# EAGLE design led (EAGLE 7.2.0)
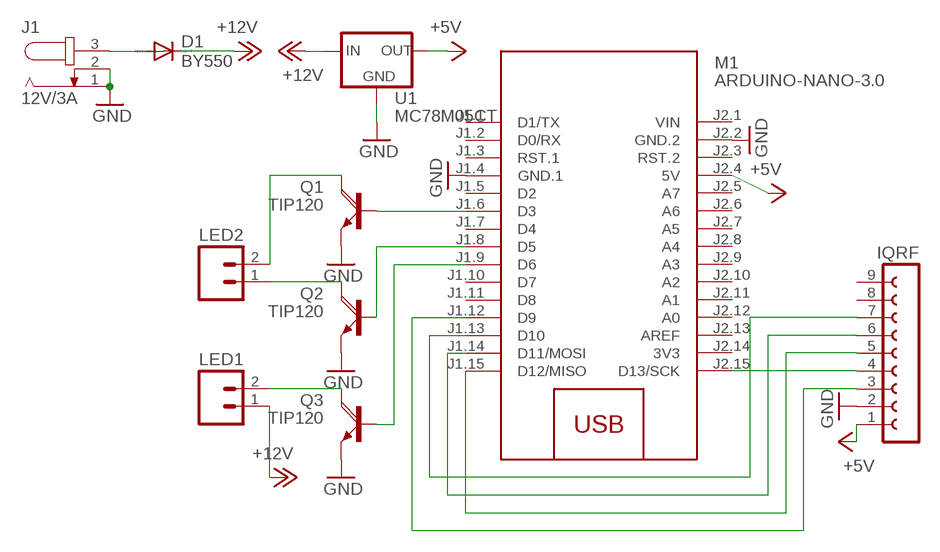
[diagram p0: schematic, sheet 1]

## Parts
D1  BY550  [DO27-15]
IQRF  FE09-1  [FE09]
J1  12V/3A  JACK-PLUG0  [SPC4077]
LED1  M025MM  [SCREWTERMINAL-5MM-2]
LED2  M025MM  [SCREWTERMINAL-5MM-2]
M1  ARDUINO-NANO-3.0  [ARDUINO-NANO-3.0]
Q1  TIP120  [TO220AH]
Q2  TIP120  [TO220AH]
Q3  TIP120  [TO220AH]
U1  MC78M05CT  V_REG_78XX-TO-220  [TO-220-ALT]

## Nets
+5V: IQRF.1 M1.J2.4(5V) U1.OUT
+12V [3amp]: D1.C LED1.1 U1.IN
GND: IQRF.2 J1.1 J1.2 M1.J1.4(GND.1) M1.J2.2(GND.2) Q1.E Q2.E Q3.E U1.GND
N$1 [3amp]: D1.A J1.3
N$2: M1.J1.6(D3) Q1.B
N$3: M1.J1.8(D5) Q2.B
N$4: M1.J1.9(D6) Q3.B
N$5 [3amp]: LED1.2 Q3.C
N$6 [3amp]: LED2.1 Q2.C
N$7 [3amp]: LED2.2 Q1.C
N$8: IQRF.4 M1.J2.15(D13/SCK)
N$9: IQRF.3 M1.J1.12(D9)
N$10: IQRF.5 M1.J1.15(D12/MISO)
N$11: IQRF.6 M1.J1.14(D11/MOSI)
N$12: IQRF.7 M1.J1.13(D10)
Unconnected: IQRF.8 IQRF.9 M1.J1.1(D1/TX) M1.J1.2(D0/RX) M1.J1.3(RST.1) M1.J1.5(D2) M1.J1.7(D4) M1.J1.10(D7) M1.J1.11(D8) M1.J2.3(RST.2) M1.J2.5(A7) M1.J2.6(A6) M1.J2.7(A5) M1.J2.8(A4) M1.J2.9(A3) M1.J2.10(A2) M1.J2.11(A1) M1.J2.12(A0) M1.J2.13(AREF)

## Power pins joined to a net without a drawn wire
3V3: M1.J2.14(3V3)
VIN: M1.J2.1(VIN)

## Library data of the parts
D1 = diode:BY550: DIODE Si200 V, 5 A
IQRF = con-lsta:FE09-1: FEMALE HEADER; OC_FARNELL: unknown; OC_NEWARK: unknown
J1 = con-jack:JACK-PLUG: DC POWER JACK Power Jack, DC, Right Angle, Through Hole, Rated 5A at 16VDC, PC Terminals Distributor: Farnell (www.Farnell.de) Drawing: 84N1161.pdf / 84N1162.pdf Manufacturer: SPC Technology (www.spctechnology.com) Type: SPC4077 / SPC 4078; OC_FARNELL: unknown; OC_NEWARK: unknown
LED1 LED2 = SparkFun-Connectors:M02: Standard 2-pin 0.1" header. Use with - straight break away headers ( PRT-00116) - right angle break away headers (PRT-00553) - swiss pins (PRT-00743) - machine pins (PRT-00117) - female headers (PRT-00115) Molex polarized connector foot print use with: PRT-08233 with associated crimp pins and housings. 2.54_SCREWTERM for use with PRT-10571. 3.5mm Screw Terminal footprints for PRT-08084 5mm Screw Terminal footprints for use with PRT-08432; STOREFRONT_ID: PRT-08432
M1 = diy-modules:ARDUINO-NANO-3.0: Arduino Nano 3.0
Q1-Q3 = transistor-power:TIP120: NPN DARLINGTON TRANSISTOR
U1 = SparkFun-PowerIC:V_REG_78XX: Voltage Regulator Standard 78xx regulator. IGO (Input Ground Output). Spark Fun Electronics SKU : COM-00107; PROD_ID: VREG-08450; SF_ID: COM-00107

## Net classes
0 default: width 0.102 mm, clearance 0.041 mm
1 3amp: width 1.016 mm, clearance 0.406 mm

## Board
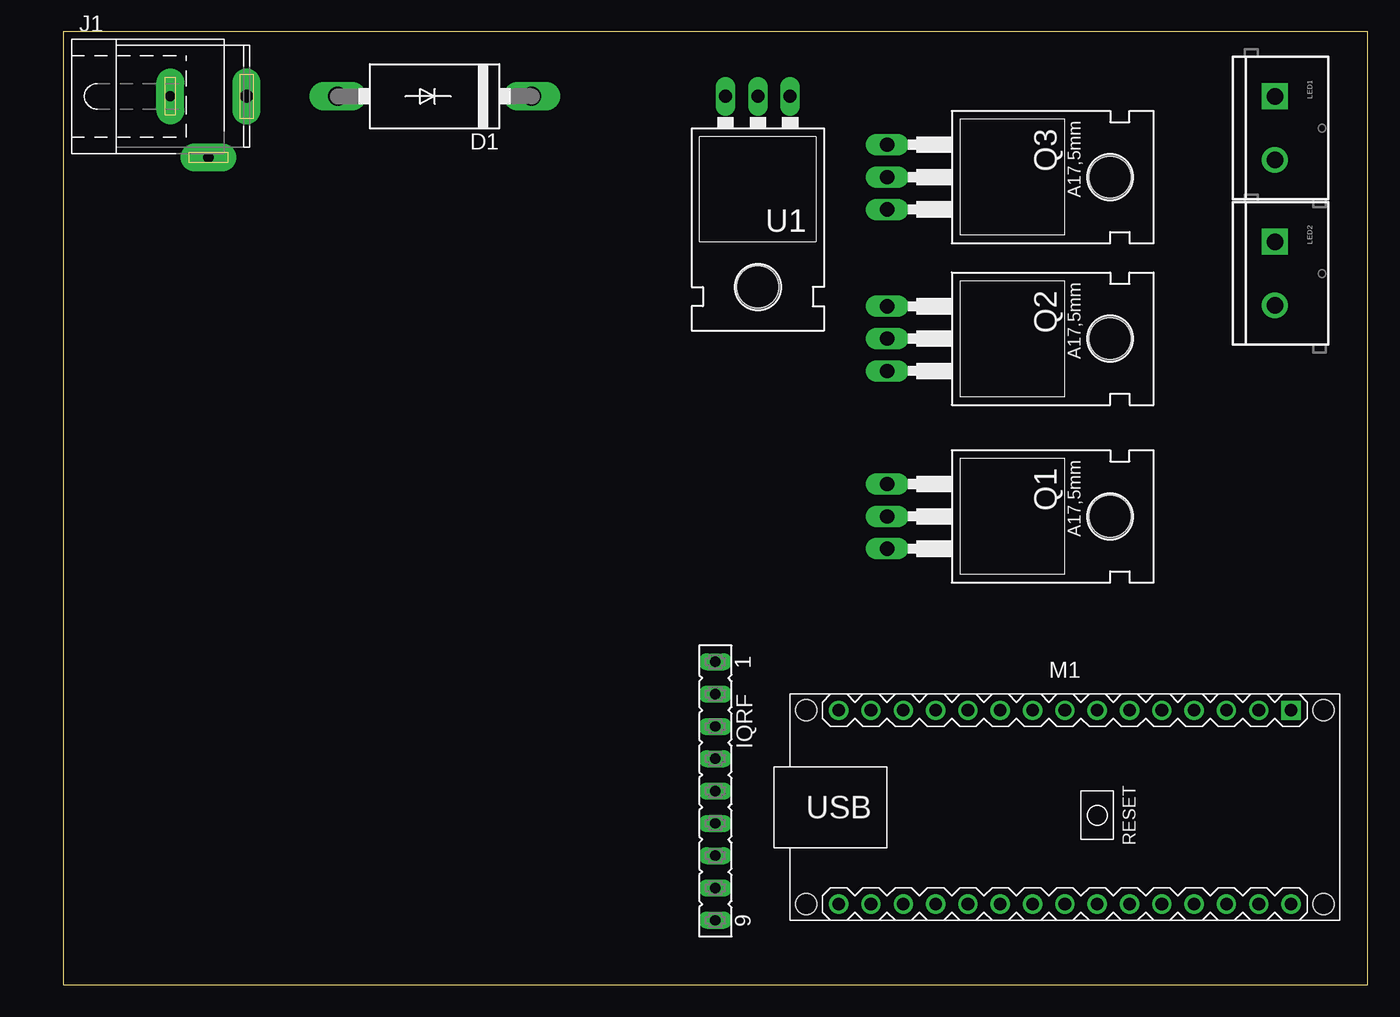
[diagram p1: board, top side]
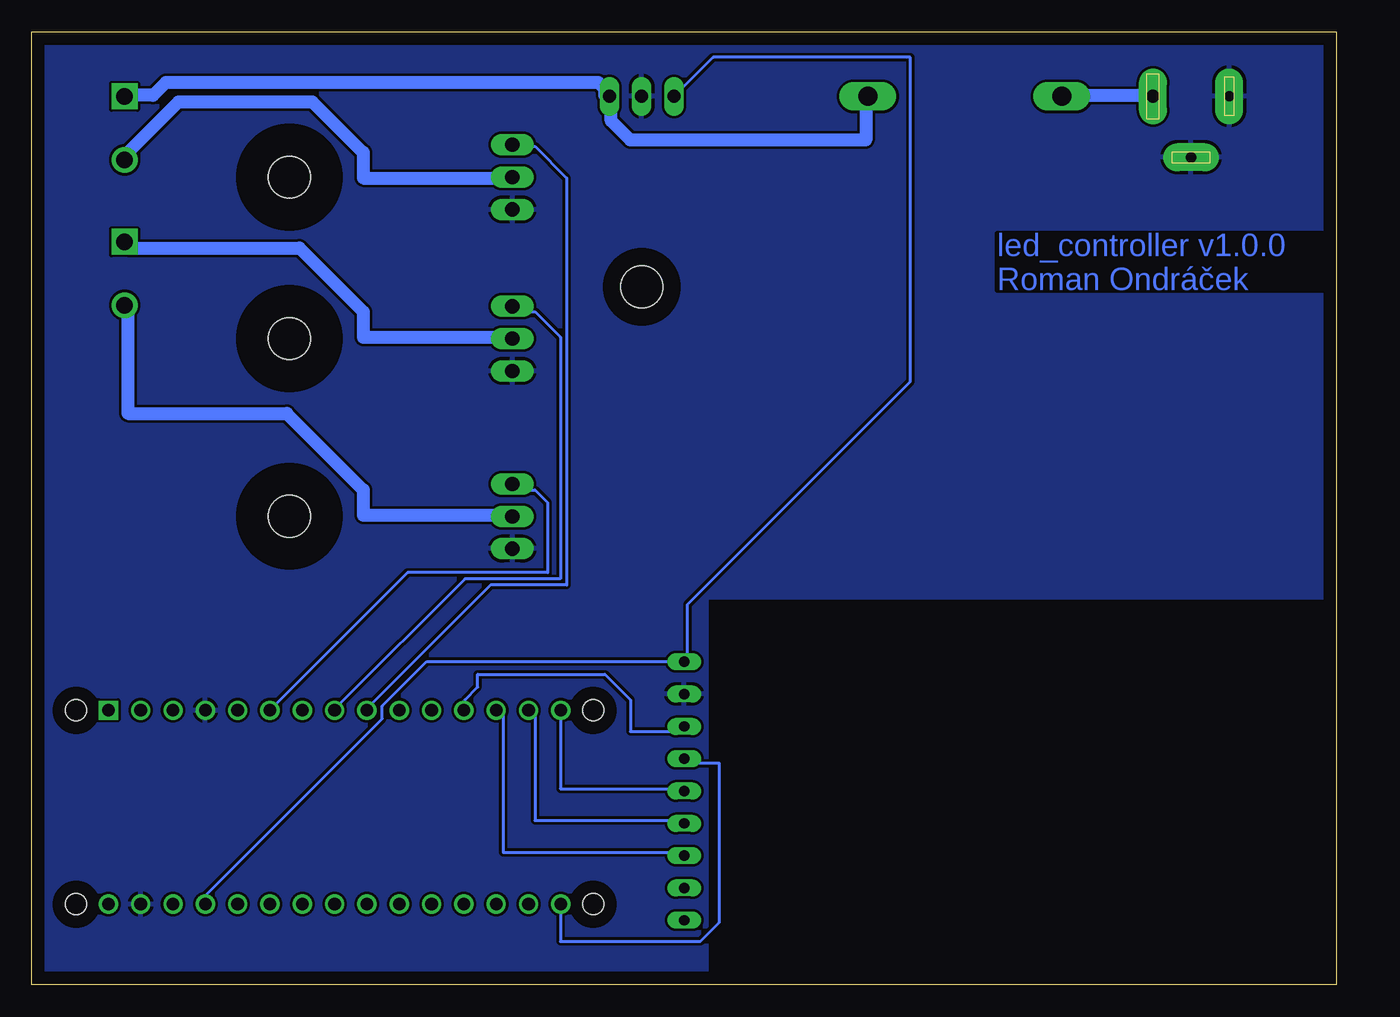
[diagram p2: board, bottom side, seen from below]

Size 102.54 x 74.92 mm. Coordinates in mm from the lower left corner, seen from the top.
Outline: 0,0 102.54,0 102.54,74.92 0,74.92 0,0
Copper layers (1*16): Top 0.035mm / dielectric 1.5mm / Bottom 0.035mm
Design rules "default": minimum track width 10mil, minimum drill 24mil, track to track 8mil, track to pad 8mil, pad to pad 8mil, via to via 8mil, smd to smd 8mil, copper to edge 40mil, drill to drill 8mil, minimum pad ring 10mil, minimum via ring 8mil, stop-mask expansion 4mil, vias tented up to drill 0mil, thermal gap 10mil

### Footprints (pad centres in the part's own frame; a part is rotated, then mirrored left to right if it is on the bottom)
DO27-15 = drill 1.499 long: A 7.62,0; C -7.62,0
FE09 = drill 0.813 long: 1 -10.16,0; 2 -7.62,0; 3 -5.08,0; 4 -2.54,0; 5 0,0; 6 2.54,0; 7 5.08,0; 8 7.62,0; 9 10.16,0
SPC4077 = drill 0.8 pad 2.184 long: 1 -3,0; 2 0,-4.8 | drill 1 pad 2.184 long: 3 3,0
SCREWTERMINAL-5MM-2 = drill 1.3 pad 2.032 square: 1 0,0 | drill 1.3 pad 2.032: 2 5,0
ARDUINO-NANO-3.0 = drill 1 square: J1.1 17.78,7.62 | drill 1: J1.2 15.24,7.62; J1.3 12.7,7.62; J1.4 10.16,7.62; J1.5 7.62,7.62; J1.6 5.08,7.62; J1.7 2.54,7.62; J1.8 0,7.62; J1.9 -2.54,7.62; J1.10 -5.08,7.62; J1.11 -7.62,7.62; J1.12 -10.16,7.62; J1.13 -12.7,7.62; J1.14 -15.24,7.62; J1.15 -17.78,7.62; J2.1 17.78,-7.62; J2.2 15.24,-7.62; J2.3 12.7,-7.62; J2.4 10.16,-7.62; J2.5 7.62,-7.62; J2.6 5.08,-7.62; J2.7 2.54,-7.62; J2.8 0,-7.62; J2.9 -2.54,-7.62; J2.10 -5.08,-7.62; J2.11 -7.62,-7.62; J2.12 -10.16,-7.62; J2.13 -12.7,-7.62; J2.14 -15.24,-7.62; J2.15 -17.78,-7.62 | hole 1.651: -20.32,7.62; -20.32,-7.62; 20.32,-7.62; 20.32,7.62
TO220AH = drill 1.118 long: B -2.54,-6.35; C 0,-6.35; E 2.54,-6.35 | hole 3.302: 0,11.176
TO-220-ALT = drill 1.016 long: GND 0,-3.81; IN -2.54,-3.81; OUT 2.54,-3.81 | hole 3.302: 0,11.176

### Placement (x,y rotation side)
D1  29.21,69.85 180 top
IQRF  51.27,15.24 270 top
J1  11.43,69.85 0 top
LED1  95.25,69.85 270 top
LED2  95.25,58.42 270 top
M1  78.74,13.97 0 top
Q1  71.12,36.83 270 top
Q2  71.12,50.8 270 top
Q3  71.12,63.5 270 top
U1  54.61,66.04 180 top

### Tracks (layer width: path | path; a pad name or v marks a point on that pad's centre or on a via)
+5V
  Bottom 0.254: M1.J2.4 89,6.42 89,6.92 75,20.92 75,21.92 71.5,25.42 51.5,25.42 IQRF.1 51,25.42 51,29.92 33.5,47.42 33.5,72.92 49,72.92 U1.OUT
+12V
  Bottom 1.016: D1.C 37,69.42 37,66.42 55.5,66.42 57,67.92 57,69.42 U1.IN 57.5,69.92 57.5,70.42 58,70.92 92,70.92 93,69.92 95,69.92 LED1.1
GND
  pour Bottom: 49.53,0 49.53,30.48 0,30.48 0,74.93 102.87,74.93 102.87,0
N$1
  Bottom 1.016: J1.3 14.5,69.92 21.5,69.92 D1.A
N$2
  Bottom 0.254: M1.J1.6 83.5,21.92 73,32.42 62,32.42 62,37.92 63,38.92 64.5,38.92 Q1.B
N$3
  Bottom 0.254: M1.J1.8 78.5,21.92 68.5,31.92 61,31.92 61,50.92 63,52.92 64.5,52.92 Q2.B
N$4
  Bottom 0.254: M1.J1.9 76,21.92 66.5,31.42 60.5,31.42 60.5,63.42 63,65.92 64.5,65.92 Q3.B
N$5
  Bottom 1.016: Q3.C 65,63.42 76.5,63.42 76.5,65.42 80.5,69.42 91,69.42 95,65.42 95,64.92 LED1.2
N$6
  Bottom 1.016: Q2.C 65,50.92 76.5,50.92 76.5,52.92 81.5,57.92 95,57.92 95,58.42 LED2.1
N$7
  Bottom 1.016: Q1.C 65,36.92 76.5,36.92 76.5,38.92 82.5,44.92 95,44.92 95,53.42 LED2.2
N$8
  Bottom 0.254: IQRF.4 51,17.42 48.5,17.42 48.5,4.92 50,3.42 61,3.42 61,5.92 M1.J2.15
N$9
  Bottom 0.254: IQRF.3 51.5,19.92 55.5,19.92 55.5,22.42 57.5,24.42 67.5,24.42 67.5,23.42 68.5,22.42 68.5,21.92 M1.J1.12
N$10
  Bottom 0.254: IQRF.5 51.5,15.42 61,15.42 61,21.42 M1.J1.15
N$11
  Bottom 0.254: IQRF.6 51.5,12.92 63,12.92 63,21.42 63.5,21.92 M1.J1.14
N$12
  Bottom 0.254: IQRF.7 51.5,10.42 65.5,10.42 65.5,21.42 66,21.92 M1.J1.13

### Text on the board
Bottom: led_controller v1.0.0 / Roman Ondráček